# Altium schematic sheet SCH_A4_Temp.SchDoc
size A4
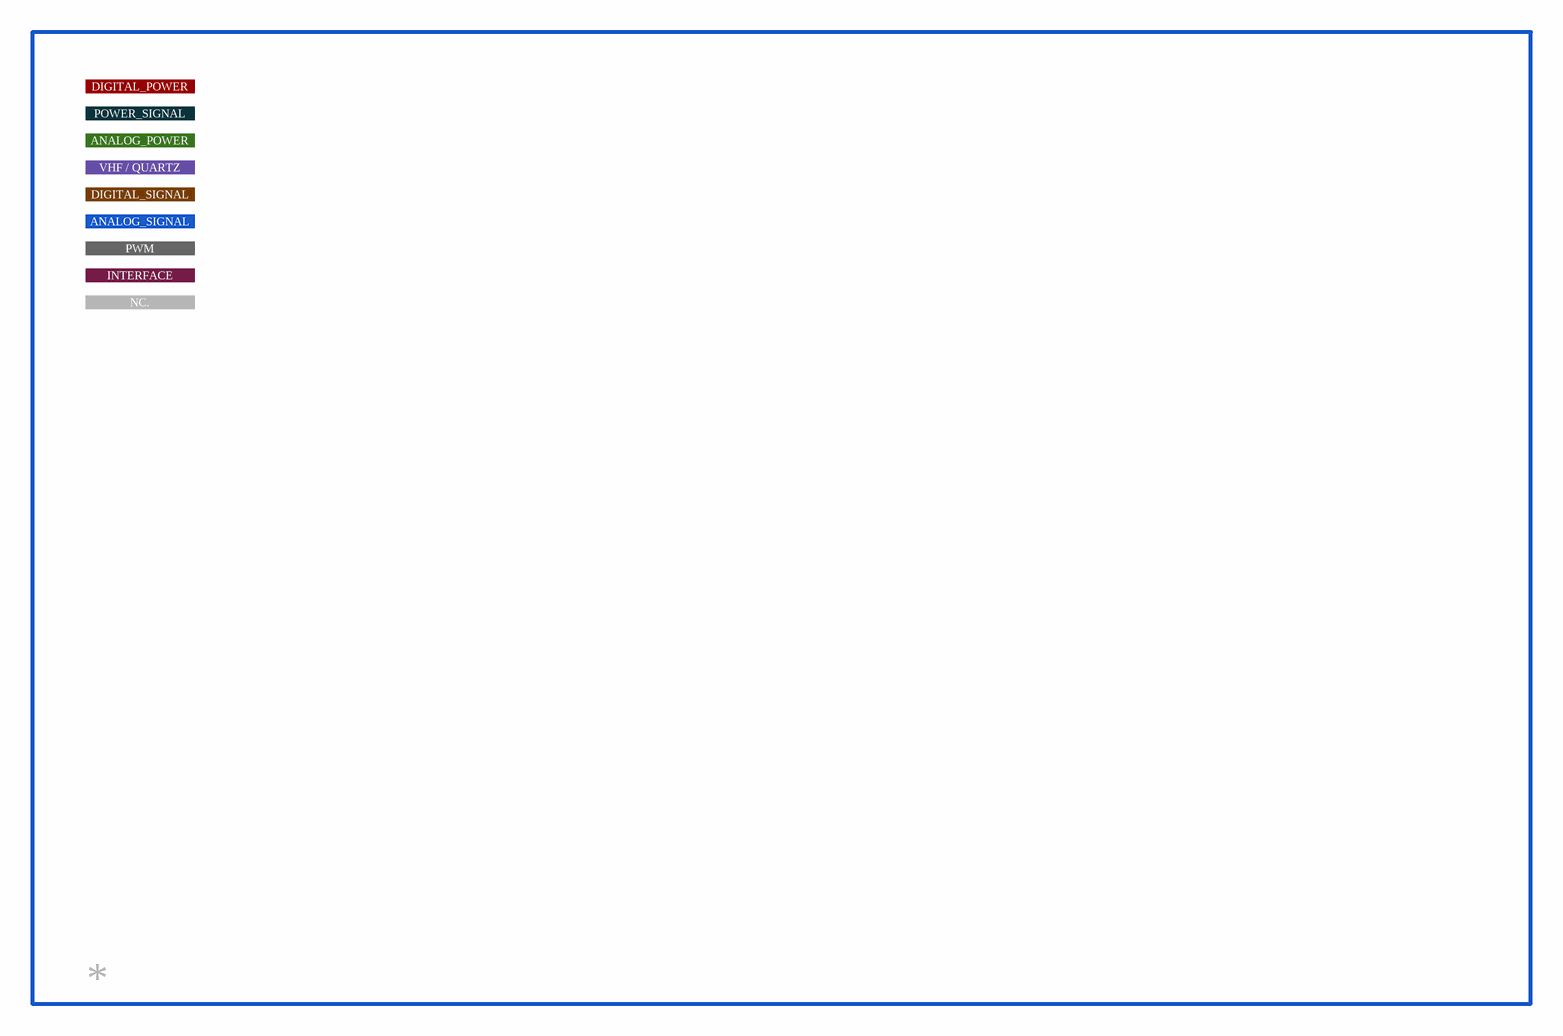
[diagram p0: SCH_A4_Temp.SchDoc]

## Ports
ANALOG_POWER, ANALOG_SIGNAL, DIGITAL_POWER, DIGITAL_SIGNAL, INTERFACE, NC., POWER_SIGNAL, PWM, VHF / QUARTZ